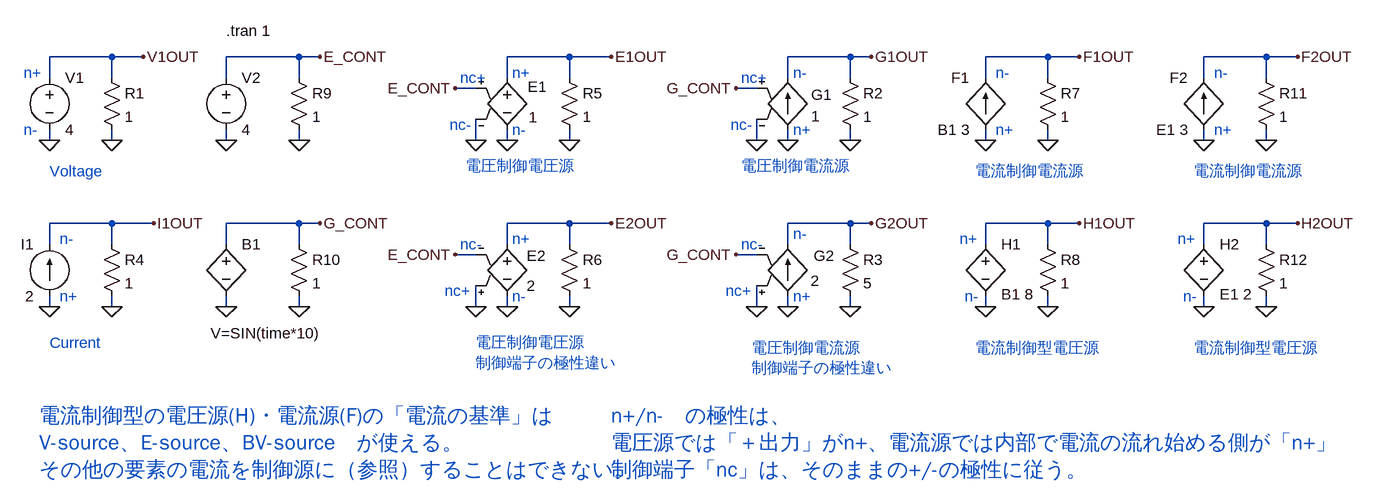
[diagram p0: schematic Fig_2-82_Element_List.asc]
Fig_2-82_Element_List.asc, the LTspice schematic file:
Version 4
SHEET 1 1860 804
WIRE -640 80 -736 80
WIRE -592 80 -640 80
WIRE -352 80 -464 80
WIRE -320 80 -352 80
WIRE 64 80 -32 80
WIRE 128 80 64 80
WIRE 496 80 400 80
WIRE 528 80 496 80
WIRE 800 80 704 80
WIRE 848 80 800 80
WIRE 1136 80 1040 80
WIRE 1184 80 1136 80
WIRE -736 112 -736 80
WIRE -640 112 -640 80
WIRE -464 112 -464 80
WIRE -352 112 -352 80
WIRE -32 112 -32 80
WIRE 64 112 64 80
WIRE 400 112 400 80
WIRE 496 112 496 80
WIRE 704 112 704 80
WIRE 800 112 800 80
WIRE 1040 112 1040 80
WIRE 1136 112 1136 80
WIRE -80 128 -112 128
WIRE 352 128 320 128
WIRE -736 208 -736 192
WIRE -640 208 -640 192
WIRE -464 208 -464 192
WIRE -352 208 -352 192
WIRE -80 208 -80 176
WIRE -32 208 -32 192
WIRE 64 208 64 192
WIRE 352 208 352 176
WIRE 400 208 400 192
WIRE 496 208 496 192
WIRE 704 208 704 192
WIRE 800 208 800 192
WIRE 1040 208 1040 192
WIRE 1136 208 1136 192
WIRE -640 336 -736 336
WIRE -576 336 -640 336
WIRE -352 336 -464 336
WIRE -320 336 -352 336
WIRE 64 336 -32 336
WIRE 128 336 64 336
WIRE 496 336 400 336
WIRE 528 336 496 336
WIRE 800 336 704 336
WIRE 848 336 800 336
WIRE 1136 336 1040 336
WIRE 1184 336 1136 336
WIRE -736 368 -736 336
WIRE -640 368 -640 336
WIRE -464 368 -464 336
WIRE -352 368 -352 336
WIRE -32 368 -32 336
WIRE 64 368 64 336
WIRE 400 368 400 336
WIRE 496 368 496 336
WIRE 704 368 704 336
WIRE 800 368 800 336
WIRE 1040 368 1040 336
WIRE 1136 368 1136 336
WIRE -80 384 -112 384
WIRE 352 384 320 384
WIRE -736 464 -736 448
WIRE -640 464 -640 448
WIRE -464 464 -464 448
WIRE -352 464 -352 448
WIRE -80 464 -80 432
WIRE -32 464 -32 448
WIRE 64 464 64 448
WIRE 352 464 352 432
WIRE 400 464 400 448
WIRE 496 464 496 448
WIRE 704 464 704 448
WIRE 800 464 800 448
WIRE 1040 464 1040 448
WIRE 1136 464 1136 448
FLAG -80 208 0
FLAG -32 208 0
FLAG 352 208 0
FLAG 400 208 0
FLAG 704 208 0
FLAG -80 464 0
FLAG -32 464 0
FLAG 352 464 0
FLAG 400 464 0
FLAG 704 464 0
FLAG 128 80 E1OUT
FLAG -112 128 E_CONT
FLAG 128 336 E2OUT
FLAG 320 128 G_CONT
FLAG 528 336 G2OUT
FLAG 848 80 F1OUT
FLAG 848 336 H1OUT
FLAG -736 464 0
FLAG -736 208 0
FLAG -576 336 I1OUT
FLAG -592 80 V1OUT
FLAG 528 80 G1OUT
FLAG 496 208 0
FLAG 496 464 0
FLAG -640 208 0
FLAG -640 464 0
FLAG -464 208 0
FLAG -320 80 E_CONT
FLAG -112 384 E_CONT
FLAG 320 384 G_CONT
FLAG -464 464 0
FLAG -320 336 G_CONT
FLAG 64 208 0
FLAG 64 464 0
FLAG 800 208 0
FLAG 800 464 0
FLAG -352 208 0
FLAG -352 464 0
FLAG 1040 208 0
FLAG 1040 464 0
FLAG 1184 80 F2OUT
FLAG 1184 336 H2OUT
FLAG 1136 208 0
FLAG 1136 464 0
SYMBOL g 400 96 R0
WINDOW 0 36 42 Left 2
WINDOW 3 36 75 Left 2
SYMATTR InstName G1
SYMATTR Value 1
SYMBOL e -32 96 R0
WINDOW 0 32 30 Left 2
WINDOW 3 33 77 Left 2
SYMATTR InstName E1
SYMATTR Value 1
SYMBOL e2 -32 352 R0
WINDOW 0 30 34 Left 2
WINDOW 3 30 80 Left 2
SYMATTR InstName E2
SYMATTR Value 2
SYMBOL g2 400 352 R0
WINDOW 0 40 34 Left 2
WINDOW 3 35 72 Left 2
SYMATTR InstName G2
SYMATTR Value 2
SYMBOL f 704 192 R180
WINDOW 0 24 80 Left 2
WINDOW 3 24 0 Left 2
SYMATTR InstName F1
SYMATTR Value B1 3
SYMBOL h 704 352 R0
WINDOW 3 24 93 Left 2
SYMATTR Value B1 8
SYMATTR InstName H1
SYMBOL voltage -736 96 R0
WINDOW 123 0 0 Left 0
WINDOW 39 0 0 Left 0
SYMATTR InstName V1
SYMATTR Value 4
SYMBOL current -736 448 R180
WINDOW 0 24 80 Left 2
WINDOW 3 24 0 Left 2
WINDOW 123 0 0 Left 0
WINDOW 39 0 0 Left 0
SYMATTR InstName I1
SYMATTR Value 2
SYMBOL res 480 96 R0
SYMATTR InstName R2
SYMATTR Value 1
SYMBOL res 480 352 R0
SYMATTR InstName R3
SYMATTR Value 5
SYMBOL res -656 96 R0
SYMATTR InstName R1
SYMATTR Value 1
SYMBOL res -656 352 R0
SYMATTR InstName R4
SYMATTR Value 1
SYMBOL voltage -464 96 R0
WINDOW 123 0 0 Left 0
WINDOW 39 0 0 Left 0
SYMATTR InstName V2
SYMATTR Value 4
SYMBOL res 48 96 R0
SYMATTR InstName R5
SYMATTR Value 1
SYMBOL res 48 352 R0
SYMATTR InstName R6
SYMATTR Value 1
SYMBOL res 784 96 R0
SYMATTR InstName R7
SYMATTR Value 1
SYMBOL res 784 352 R0
SYMATTR InstName R8
SYMATTR Value 1
SYMBOL res -368 96 R0
SYMATTR InstName R9
SYMATTR Value 1
SYMBOL res -368 352 R0
SYMATTR InstName R10
SYMATTR Value 1
SYMBOL bv -464 352 R0
WINDOW 3 -24 153 Left 2
SYMATTR Value V=SIN(time*10)
SYMATTR InstName B1
SYMBOL f 1040 192 R180
WINDOW 0 24 80 Left 2
WINDOW 3 24 0 Left 2
SYMATTR InstName F2
SYMATTR Value E1 3
SYMBOL h 1040 352 R0
WINDOW 3 24 93 Left 2
SYMATTR Value E1 2
SYMATTR InstName H2
SYMBOL res 1120 96 R0
SYMATTR InstName R11
SYMATTR Value 1
SYMBOL res 1120 352 R0
SYMATTR InstName R12
SYMATTR Value 1
TEXT -736 520 Left 2 ;Current
TEXT -736 256 Left 2 ;Voltage
TEXT -96 248 Left 2 ;電圧制御電圧源
TEXT 328 248 Left 2 ;電圧制御電流源
TEXT 344 528 Left 2 ;電圧制御電流源\n制御端子の極性違い
TEXT -80 520 Left 2 ;電圧制御電圧源\n制御端子の極性違い
TEXT 688 256 Left 2 ;電流制御電流源
TEXT -464 40 Left 2 !.tran 1
TEXT 408 192 Left 2 ;n+
TEXT 408 104 Left 2 ;n-
TEXT 328 112 Left 2 ;nc+
TEXT 312 184 Left 2 ;nc-
TEXT -24 104 Left 2 ;n+
TEXT -104 112 Left 2 ;nc+
TEXT -120 184 Left 2 ;nc-
TEXT -24 360 Left 2 ;n+
TEXT -24 192 Left 2 ;n-
TEXT -24 448 Left 2 ;n-
TEXT -128 440 Left 2 ;nc+
TEXT -104 368 Left 2 ;nc-
TEXT 408 448 Left 2 ;n+
TEXT 408 352 Left 2 ;n-
TEXT 304 440 Left 2 ;nc+
TEXT 328 368 Left 2 ;nc-
TEXT 664 360 Left 2 ;n+
TEXT 672 448 Left 2 ;n-
TEXT 720 192 Left 2 ;n+
TEXT 720 104 Left 2 ;n-
TEXT -776 104 Left 2 ;n+
TEXT -776 192 Left 2 ;n-
TEXT -720 448 Left 2 ;n+
TEXT -720 360 Left 2 ;n-
TEXT 128 632 Left 3 ;n+/n-　の極性は、\n電圧源では「＋出力」がn+、電流源では内部で電流の流れ始める側が「n+」\n制御端子「nc」は、そのままの+/-の極性に従う。
TEXT 688 528 Left 2 ;電流制御型電圧源
TEXT -752 632 Left 3 ;電流制御型の電圧源(H)・電流源(F)の「電流の基準」は\nV-source、E-source、BV-source　が使える。\nその他の要素の電流を制御源に（参照）することはできない。
TEXT 1024 256 Left 2 ;電流制御電流源
TEXT 1000 360 Left 2 ;n+
TEXT 1008 448 Left 2 ;n-
TEXT 1056 192 Left 2 ;n+
TEXT 1056 104 Left 2 ;n-
TEXT 1024 528 Left 2 ;電流制御型電圧源

The netlist it stands for:
* Fig_2-82_Element_List.asc
G1 0 G1OUT G_CONT 0 1
E1 E1OUT 0 E_CONT 0 1
E2 E2OUT 0 0 E_CONT 2
G2 0 G2OUT 0 G_CONT 2
F1 0 F1OUT B1 3
H1 H1OUT 0 B1 8
V1 V1OUT 0 4
I1 0 I1OUT 2
R2 G1OUT 0 1
R3 G2OUT 0 5
R1 V1OUT 0 1
R4 I1OUT 0 1
V2 E_CONT 0 4
R5 E1OUT 0 1
R6 E2OUT 0 1
R7 F1OUT 0 1
R8 H1OUT 0 1
R9 E_CONT 0 1
R10 G_CONT 0 1
B1 G_CONT 0 V=SIN(time*10)
F2 0 F2OUT E1 3
H2 H2OUT 0 E1 2
R11 F2OUT 0 1
R12 H2OUT 0 1
* Current
* Voltage
* 電圧制御電圧源
* 電圧制御電流源
* 電圧制御電流源
* 制御端子の極性違い
* 電圧制御電圧源
* 制御端子の極性違い
* 電流制御電流源
.tran 1
* n+
* n-
* nc+
* nc-
* n+
* nc+
* nc-
* n+
* n-
* n-
* nc+
* nc-
* n+
* n-
* nc+
* nc-
* n+
* n-
* n+
* n-
* n+
* n-
* n+
* n-
* n+/n-　の極性は、
* 電圧源では「＋出力」がn+、電流源では内部で電流の流れ始める側が「n+」
* 制御端子「nc」は、そのままの+/-の極性に従う。
* 電流制御型電圧源
* 電流制御型の電圧源(H)・電流源(F)の「電流の基準」は
* V-source、E-source、BV-source　が使える。
* その他の要素の電流を制御源に（参照）することはできない。
* 電流制御電流源
* n+
* n-
* n+
* n-
* 電流制御型電圧源
.backanno
.end